# Altium schematic sheet 08)RS232,RS485.SchDoc
size 297 x 209 mm
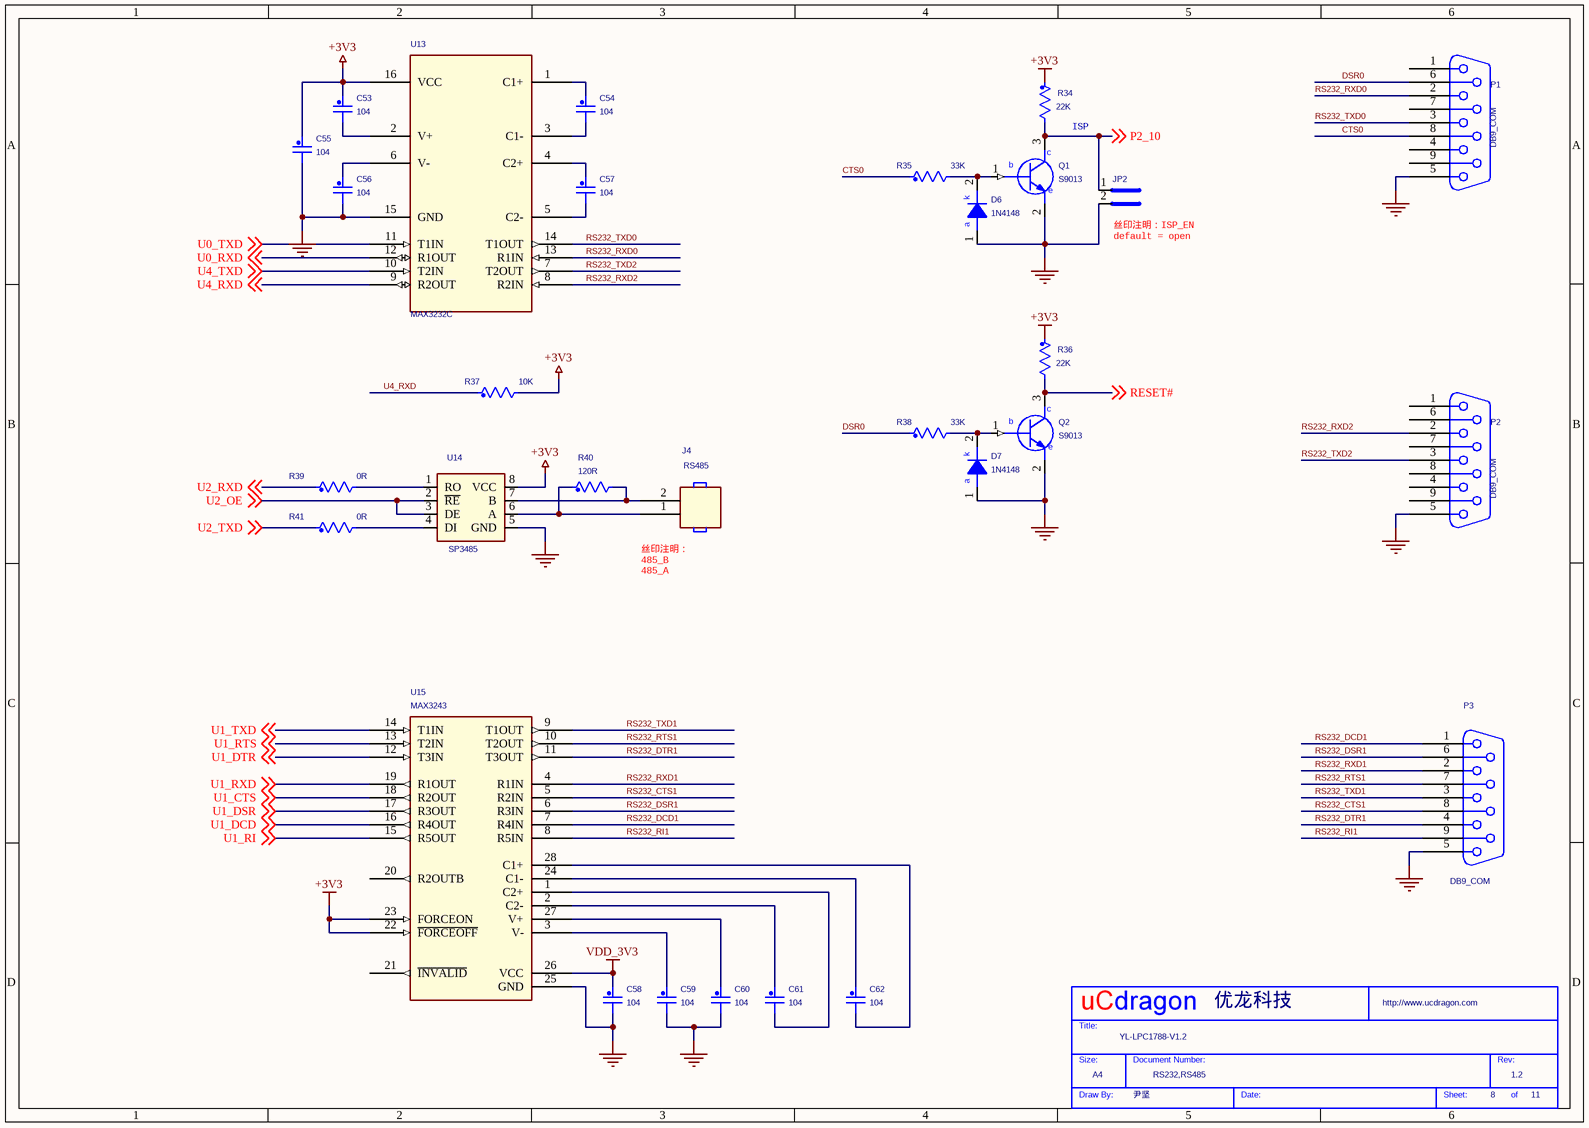
[diagram p0: 08)RS232,RS485.SchDoc]

## Parts
*  Page Count: 11  Page Number: 8  Page Size: A4  Title: YL-LPC1788-V1.2  RevCode: 1.2  Doc: RS232,RS485  Drawing: 尹坚  Company: 优龙科技  (hidden comment: My Title 0)  (graphical)
C53  104  [CAP0805]
C54  104  [CAP0805]
C55  104  [CAP0805]
C56  104  [CAP0805]
C57  104  [CAP0805]
C58  104  [CAP0805]
C59  104  [CAP0805]
C60  104  [CAP0805]
C61  104  [CAP0805]
C62  104  [CAP0805]
D6  1N4148  [1N4148SMD]
D7  1N4148  [1N4148SMD]
J4  RS485  [CON-2PIN]
JP2  2Pin  (value not drawn)
P1  DB9_COM  [DB9-1I]
P2  DB9_COM  [DB9-1I]
P3  DB9_COM  [DB9-1I]
Q1  S9013  [S9013SMD]
Q2  S9013  [S9013SMD]
R34  22K  [RES0805]
R35  33K  [RES0805]
R36  22K  [RES0805]
R37  10K  [RES0805]
R38  33K  [RES0805]
R39  0R
R40  120R
R41  0R
U13  MAX3232C  [MAX3232ESA-SO16]
U14  SP3485
U15  MAX3243  [MAX3243-SSOP28]

## Nets
+3V3: C53.1 C55.1 R34.1 R36.1 R37.2 U13.16(VCC) U14.8(VCC) U15.22(~{FORCEOFF}) U15.23(FORCEON)
GND_POWER: C55.2 C56.2 C58.2 C59.2 C60.2 D6.1(ANODE) D7.1(ANODE) JP2.2 P1.5 P2.5 P3.5 Q1.2(E) Q2.2(E) U13.15(GND) U14.5(GND) U15.25(GND)
VDD_3V3: C58.1 U15.26(VCC)
CTS0: P1.8 R35.1
DSR0: P1.6 R38.1
P2_10: JP2.1 Q1.3(C) R34.2 ; off-sheet P2_10
RESET#: Q2.3(C) R36.2 ; off-sheet RESET#
RS232_CTS1: P3.8 U15.5(R2IN)
RS232_DCD1: P3.1 U15.7(R4IN)
RS232_DSR1: P3.6 U15.6(R3IN)
RS232_DTR1: P3.4 U15.11(T3OUT)
RS232_RI1: P3.9 U15.8(R5IN)
RS232_RTS1: P3.7 U15.10(T2OUT)
RS232_RXD0: P1.2 U13.13(R1IN)
RS232_RXD1: P3.2 U15.4(R1IN)
RS232_RXD2: P2.2 U13.8(R2IN)
RS232_TXD0: P1.3 U13.14(T1OUT)
RS232_TXD1: P3.3 U15.9(T1OUT)
RS232_TXD2: P2.3 U13.7(T2OUT)
U0_RXD: U13.12(R1OUT) ; off-sheet U0_RXD
U0_TXD: U13.11(T1IN) ; off-sheet U0_TXD
U1_CTS: U15.18(R2OUT) ; off-sheet U1_CTS
U1_DCD: U15.16(R4OUT) ; off-sheet U1_DCD
U1_DSR: U15.17(R3OUT) ; off-sheet U1_DSR
U1_DTR: U15.12(T3IN) ; off-sheet U1_DTR
U1_RI: U15.15(R5OUT) ; off-sheet U1_RI
U1_RTS: U15.13(T2IN) ; off-sheet U1_RTS
U1_RXD: U15.19(R1OUT) ; off-sheet U1_RXD
U1_TXD: U15.14(T1IN) ; off-sheet U1_TXD
U2_OE: U14.2(~{RE}) U14.3(DE) ; off-sheet U2_OE
U2_RXD: R39.1 ; off-sheet U2_RXD
U2_TXD: R41.1 ; off-sheet U2_TXD
U4_RXD: R37.1 U13.9(R2OUT) ; off-sheet U4_RXD
U4_TXD: U13.10(T2IN) ; off-sheet U4_TXD
NetC53_2: C53.2 U13.2(V+)
NetC54_1: C54.1 U13.1(C1+)
NetC54_2: C54.2 U13.3(C1-)
NetC56_1: C56.1 U13.6(V-)
NetC57_1: C57.1 U13.4(C2+)
NetC57_2: C57.2 U13.5(C2-)
NetC59_1: C59.1 U15.3(V-)
NetC60_1: C60.1 U15.27(V+)
NetC61_1: C61.1 U15.2(C2-)
NetC61_2: C61.2 U15.1(C2+)
NetC62_1: C62.1 U15.24(C1-)
NetC62_2: C62.2 U15.28(C1+)
NetD6_2: D6.2(CATHODE) Q1.1(B) R35.2
NetD7_2: D7.2(CATHODE) Q2.1(B) R38.2
NetJ4_1: J4.1 R40.1 U14.6(A)
NetJ4_2: J4.2 R40.2 U14.7(B)
NetR39_2: R39.2 U14.1(RO)
NetR41_2: R41.2 U14.4(DI)

Not connected (* = marked no-connect by the designer): P1 1 4 7 9; P2 1 4 6 7 8 9; U15 20(R2OUTB) 21(~{INVALID})

## Notes on the sheet
- ISP
- (near JP2) 丝印注明：ISP_EN
  default = open
- (near J4) 丝印注明：
  485_B
  485_A
- (in symbol 1N4148SMD) k; a
- (in symbol My Title 0) Title:; Size:; Document Number:; Rev:; Draw By:; Date:; Sheet:; of
- (in symbol S9013SMD_Dup1) c; b; e

## Library data of the parts
C53-C62 = C_Generic_Dup1: Dielectric: X7R; Mfg #1: KEMET; Voltage: 16V; P/N #1: C0603C104K4RAC; Toler.: 10%
D6 D7 = 1N4148SMD
J4 = HEADER 2
P1-P3 = CONNECTOR DB9
Q1 Q2 = S9013SMD_Dup1
R34-R38 = R_Generic_Dup1: Toler.: 1%; Watts: 0.1W; P/N #1: CR10-1001F-T; Mfg #1: AVX
R39-R41 = R_Generic_Dup2
U13 = max232_1
* = My Title 0: Page Create Date: May 29, 2006; WebSite: http://www.ucdragon.com